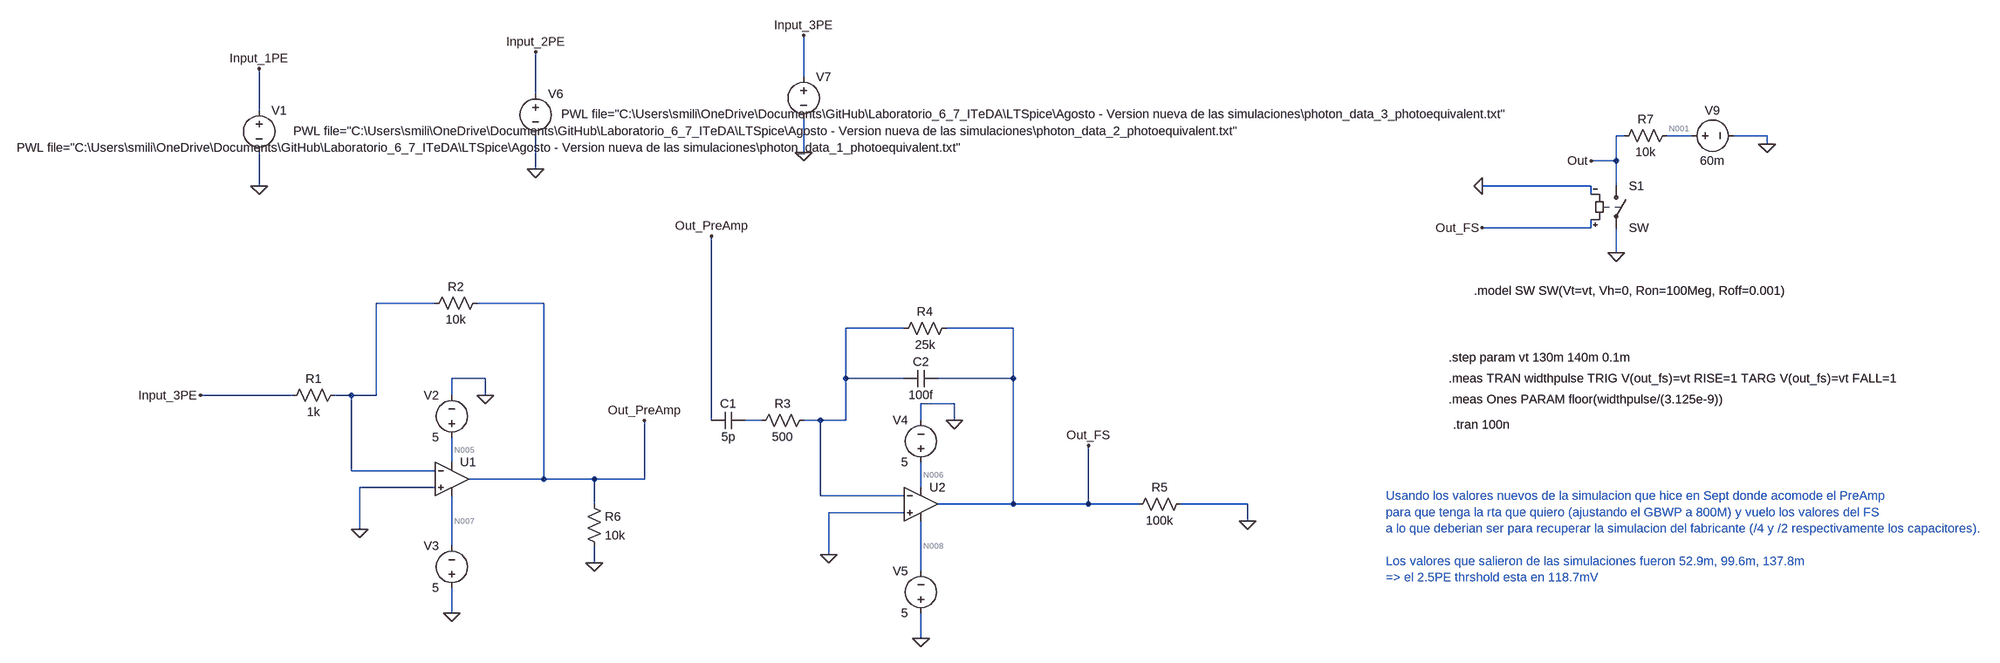
[diagram p0: schematic threshold_calculator_new_ajustada_a_ojo.asc]
threshold_calculator_new_ajustada_a_ojo.asc, the LTspice schematic file:
Version 4
SHEET 1 2936 852
WIRE 576 -656 576 -736
WIRE 64 -624 64 -704
WIRE -464 -592 -464 -672
WIRE 2144 -544 2128 -544
WIRE 2272 -544 2224 -544
WIRE 2416 -544 2352 -544
WIRE 2416 -528 2416 -544
WIRE 576 -512 576 -576
WIRE 2128 -496 2128 -544
WIRE 2128 -496 2080 -496
WIRE 64 -480 64 -544
WIRE -464 -448 -464 -512
WIRE 2080 -448 1872 -448
WIRE 2128 -448 2128 -496
WIRE 2080 -432 2080 -448
WIRE 2080 -368 2080 -384
WIRE 2080 -368 1872 -368
WIRE 2128 -320 2128 -368
WIRE -128 -224 -240 -224
WIRE 80 -224 -48 -224
WIRE 768 -176 656 -176
WIRE 976 -176 848 -176
WIRE -32 -80 -96 -80
WIRE 656 -80 656 -176
WIRE 768 -80 656 -80
WIRE 976 -80 976 -176
WIRE 976 -80 832 -80
WIRE -400 -48 -576 -48
WIRE -288 -48 -320 -48
WIRE -240 -48 -240 -224
WIRE -240 -48 -288 -48
WIRE -96 -48 -96 -80
WIRE -32 -48 -32 -80
WIRE 864 -32 800 -32
WIRE 400 0 400 -352
WIRE 496 0 464 0
WIRE 608 0 576 0
WIRE 656 0 656 -80
WIRE 656 0 608 0
WIRE 800 0 800 -32
WIRE 864 0 864 -32
WIRE -96 80 -96 32
WIRE -288 96 -288 -48
WIRE -128 96 -288 96
WIRE 80 112 80 -224
WIRE 80 112 -64 112
WIRE 176 112 80 112
WIRE 272 112 272 0
WIRE 272 112 176 112
WIRE -128 128 -272 128
WIRE 800 128 800 80
WIRE 608 144 608 0
WIRE 768 144 608 144
WIRE 176 160 176 112
WIRE 976 160 976 -80
WIRE 976 160 832 160
WIRE 1120 160 1120 48
WIRE 1120 160 976 160
WIRE 1216 160 1120 160
WIRE 1424 160 1296 160
WIRE 768 176 624 176
WIRE 1424 192 1424 160
WIRE -272 208 -272 128
WIRE -96 240 -96 144
WIRE 624 256 624 176
WIRE 176 272 176 240
WIRE 800 288 800 192
WIRE -96 368 -96 320
WIRE 800 416 800 368
FLAG -96 368 0
FLAG -32 -48 0
FLAG -464 -448 0
FLAG -272 208 0
FLAG 800 416 0
FLAG 864 0 0
FLAG 624 256 0
FLAG 272 0 Out_PreAmp
FLAG 1120 48 Out_FS
FLAG 1424 192 0
FLAG 400 -352 Out_PreAmp
FLAG -464 -672 Input_1PE
FLAG 64 -480 0
FLAG 64 -704 Input_2PE
FLAG -576 -48 Input_3PE
FLAG 176 272 0
FLAG 576 -512 0
FLAG 576 -736 Input_3PE
FLAG 2128 -320 0
FLAG 2416 -528 0
FLAG 2080 -496 Out
FLAG 1872 -448 0
FLAG 1872 -368 Out_FS
SYMBOL res -304 -64 R90
WINDOW 0 0 56 VBottom 2
WINDOW 3 32 56 VTop 2
SYMATTR InstName R1
SYMATTR Value 1k
SYMBOL res -32 -240 R90
WINDOW 0 0 56 VBottom 2
WINDOW 3 32 56 VTop 2
SYMATTR InstName R2
SYMATTR Value 10k
SYMBOL voltage -96 48 R180
WINDOW 0 24 96 Left 2
WINDOW 3 24 16 Left 2
WINDOW 123 0 0 Left 0
WINDOW 39 0 0 Left 0
SYMATTR InstName V2
SYMATTR Value 5
SYMBOL voltage -96 336 R180
WINDOW 0 24 96 Left 2
WINDOW 3 24 16 Left 2
WINDOW 123 0 0 Left 0
WINDOW 39 0 0 Left 0
SYMATTR InstName V3
SYMATTR Value 5
SYMBOL OpAmps\\UniversalOpAmp1 -96 112 R0
SYMATTR InstName U1
SYMATTR Value2 Avol=1Meg GBW=800Meg Vos=0
SYMBOL res 592 -16 R90
WINDOW 0 0 56 VBottom 2
WINDOW 3 32 56 VTop 2
SYMATTR InstName R3
SYMATTR Value 500
SYMBOL res 864 -192 R90
WINDOW 0 0 56 VBottom 2
WINDOW 3 32 56 VTop 2
SYMATTR InstName R4
SYMATTR Value 25k
SYMBOL voltage 800 96 R180
WINDOW 0 24 96 Left 2
WINDOW 3 24 16 Left 2
WINDOW 123 0 0 Left 0
WINDOW 39 0 0 Left 0
SYMATTR InstName V4
SYMATTR Value 5
SYMBOL voltage 800 384 R180
WINDOW 0 24 96 Left 2
WINDOW 3 24 16 Left 2
WINDOW 123 0 0 Left 0
WINDOW 39 0 0 Left 0
SYMATTR InstName V5
SYMATTR Value 5
SYMBOL OpAmps\\UniversalOpAmp1 800 160 R0
SYMATTR InstName U2
SYMATTR Value2 Avol=1Meg GBW=800Meg Vos=0
SYMBOL voltage -464 -608 R0
WINDOW 3 -463 87 Left 2
WINDOW 123 0 0 Left 0
WINDOW 39 0 0 Left 0
SYMATTR Value PWL file="C:\Users\smili\OneDrive\Documents\GitHub\Laboratorio_6_7_ITeDA\LTSpice\Agosto - Version nueva de las simulaciones\photon_data_1_photoequivalent.txt"
SYMATTR InstName V1
SYMBOL res 1312 144 R90
WINDOW 0 0 56 VBottom 2
WINDOW 3 32 56 VTop 2
SYMATTR InstName R5
SYMATTR Value 100k
SYMBOL cap 464 -16 R90
WINDOW 0 0 32 VBottom 2
WINDOW 3 32 32 VTop 2
SYMATTR InstName C1
SYMATTR Value 5p
SYMBOL cap 832 -96 R90
WINDOW 0 0 32 VBottom 2
WINDOW 3 32 32 VTop 2
SYMATTR InstName C2
SYMATTR Value 100f
SYMBOL voltage 64 -640 R0
WINDOW 3 -463 87 Left 2
WINDOW 123 0 0 Left 0
WINDOW 39 0 0 Left 0
SYMATTR Value PWL file="C:\Users\smili\OneDrive\Documents\GitHub\Laboratorio_6_7_ITeDA\LTSpice\Agosto - Version nueva de las simulaciones\photon_data_2_photoequivalent.txt"
SYMATTR InstName V6
SYMBOL res 160 144 R0
SYMATTR InstName R6
SYMATTR Value 10k
SYMBOL voltage 576 -672 R0
WINDOW 3 -463 87 Left 2
WINDOW 123 0 0 Left 0
WINDOW 39 0 0 Left 0
SYMATTR Value PWL file="C:\Users\smili\OneDrive\Documents\GitHub\Laboratorio_6_7_ITeDA\LTSpice\Agosto - Version nueva de las simulaciones\photon_data_3_photoequivalent.txt"
SYMATTR InstName V7
SYMBOL sw 2128 -464 R0
SYMATTR InstName S1
SYMBOL voltage 2256 -544 R270
WINDOW 0 32 56 VTop 2
WINDOW 3 -32 56 VBottom 2
WINDOW 123 0 0 Left 0
WINDOW 39 0 0 Left 0
SYMATTR InstName V9
SYMATTR Value 60m
SYMBOL res 2240 -560 R90
WINDOW 0 0 56 VBottom 2
WINDOW 3 32 56 VTop 2
SYMATTR InstName R7
SYMATTR Value 10k
TEXT 1816 8 Left 2 !.tran 100n
TEXT 1856 -248 Left 2 !.model SW SW(Vt=vt, Vh=0, Ron=100Meg, Roff=0.001)
TEXT 1808 -120 Left 2 !.step param vt 130m 140m 0.1m
TEXT 1808 -40 Left 2 !.meas Ones PARAM floor(widthpulse/(3.125e-9))
TEXT 1808 -80 Left 2 !.meas TRAN widthpulse TRIG V(out_fs)=vt RISE=1 TARG V(out_fs)=vt FALL=1
TEXT 1688 144 Left 2 ;Usando los valores nuevos de la simulacion que hice en Sept donde acomode el PreAmp\npara que tenga la rta que quiero (ajustando el GBWP a 800M) y vuelo los valores del FS\na lo que deberian ser para recuperar la simulacion del fabricante (/4 y /2 respectivamente los capacitores).\n \nLos valores que salieron de las simulaciones fueron 52.9m, 99.6m, 137.8m\n=> el 2.5PE thrshold esta en 118.7mV

The netlist it stands for:
* threshold_calculator_new_ajustada_a_ojo.asc
R1 N002 Input_3PE 1k
R2 Out_PreAmp N002 10k
V2 N005 0 5
V3 0 N007 5
XU1 0 N002 N005 N007 Out_PreAmp level1 Avol=1Meg GBW=800Meg Vos=0 En=0 Enk=0 In=0 Ink=0 Rin=500Meg  ; pins In+ In- V+ V- OUT
R3 N003 N004 500
R4 Out_FS N003 25k
V4 N006 0 5
V5 0 N008 5
XU2 0 N003 N006 N008 Out_FS level1 Avol=1Meg GBW=800Meg Vos=0 En=0 Enk=0 In=0 Ink=0 Rin=500Meg  ; pins In+ In- V+ V- OUT
V1 Input_1PE 0 PWL file="C:\Users\smili\OneDrive\Documents\GitHub\Laboratorio_6_7_ITeDA\LTSpice\Agosto - Version nueva de las simulaciones\photon_data_1_photoequivalent.txt"
R5 0 Out_FS 100k
C1 N004 Out_PreAmp 5p
C2 Out_FS N003 100f
V6 Input_2PE 0 PWL file="C:\Users\smili\OneDrive\Documents\GitHub\Laboratorio_6_7_ITeDA\LTSpice\Agosto - Version nueva de las simulaciones\photon_data_2_photoequivalent.txt"
R6 Out_PreAmp 0 10k
V7 Input_3PE 0 PWL file="C:\Users\smili\OneDrive\Documents\GitHub\Laboratorio_6_7_ITeDA\LTSpice\Agosto - Version nueva de las simulaciones\photon_data_3_photoequivalent.txt"
S1 Out 0 Out_FS 0 SW
V9 N001 0 60m
R7 N001 Out 10k
.tran 100n
.model SW SW(Vt=vt, Vh=0, Ron=100Meg, Roff=0.001)
.step param vt 130m 140m 0.1m
.meas Ones PARAM floor(widthpulse/(3.125e-9))
.meas TRAN widthpulse TRIG V(out_fs)=vt RISE=1 TARG V(out_fs)=vt FALL=1
* Usando los valores nuevos de la simulacion que hice en Sept donde acomode el PreAmp
* para que tenga la rta que quiero (ajustando el GBWP a 800M) y vuelo los valores del FS
* a lo que deberian ser para recuperar la simulacion del fabricante (/4 y /2 respectivamente los capacitores).
* Los valores que salieron de las simulaciones fueron 52.9m, 99.6m, 137.8m
* => el 2.5PE thrshold esta en 118.7mV
.lib UniversalOpAmp1.lib
.backanno
.end

* Results of the author's LTspice run, read from the files saved beside the schematic
* Operating Point (first step), zero values left out:
*   vt = 130 m
*   V(n005) = 5 V
*   V(n007) = -5 V
*   V(n006) = 5 V
*   V(n008) = -5 V
*   V(out) = 6 nV
*   V(n001) = 60 mV
*   I(R7) = 6 µA
*   I(S1) = -6 µA
*   I(V2) = -10 nA
*   I(V3) = -10 nA
*   I(V4) = -10 nA
*   I(V5) = -10 nA
*   I(V9) = -6 µA
*   Ix(u1:3) = 10 nA
*   Ix(u1:4) = -10 nA
*   Ix(u2:3) = 10 nA
*   Ix(u2:4) = -10 nA
* From the log:
*   Measurement: ones
*     step  floor(widthpulse/(3.125e-9))
*        1  1
*        2  1
*        3  1
*        4  1
*        5  1
*        6  1
*        7  1
*        8  1
*        9  1
*       10  1
*       11  1
*       12  1
*       13  1
*       14  1
*       15  1
*       16  1
*       17  1
*       18  1
*       19  1
*       20  1
*       21  1
*       22  1
*       23  1
*       24  1
*       25  1
*       26  1
*       27  1
*       28  1
*       29  1
*       30  1
*       31  1
*       32  1
*       33  1
*       34  1
*       35  1
*       36  1
*       37  1
*       38  1
*       39  1
*       40  1
*     ...
*   Measurement: widthpulse
*     step  widthpulse  FROM  TO
*        1  4.29372e-09  4.8056e-09  9.09932e-09
*        2  4.28047e-09  4.81101e-09  9.09148e-09
*        3  4.26719e-09  4.81644e-09  9.08362e-09
*        4  4.25385e-09  4.82189e-09  9.07575e-09
*        5  4.24045e-09  4.82738e-09  9.06783e-09
*        6  4.22701e-09  4.83286e-09  9.05987e-09
*        7  4.21357e-09  4.83834e-09  9.05191e-09
*        8  4.20009e-09  4.84385e-09  9.04395e-09
*        9  4.1866e-09  4.84939e-09  9.03599e-09
*       10  4.17307e-09  4.85492e-09  9.02799e-09
*       11  4.15954e-09  4.86046e-09  9.02e-09
*       12  4.14598e-09  4.86599e-09  9.01197e-09
*       13  4.13236e-09  4.87155e-09  9.00391e-09
*       14  4.11861e-09  4.87719e-09  8.9958e-09
*       15  4.10485e-09  4.88284e-09  8.98769e-09
*       16  4.09104e-09  4.88854e-09  8.97958e-09
*       17  4.07721e-09  4.89424e-09  8.97145e-09
*       18  4.06335e-09  4.89995e-09  8.9633e-09
*       19  4.04945e-09  4.90571e-09  8.95515e-09
*       20  4.0355e-09  4.91147e-09  8.94697e-09
*       21  4.02153e-09  4.91723e-09  8.93876e-09
*       22  4.0075e-09  4.92299e-09  8.93049e-09
*       23  3.99347e-09  4.92875e-09  8.92222e-09
*       24  3.97941e-09  4.93451e-09  8.91392e-09
*       25  3.96525e-09  4.94037e-09  8.90562e-09
*       26  3.95104e-09  4.94626e-09  8.89731e-09
*       27  3.93681e-09  4.95217e-09  8.88898e-09
*       28  3.9225e-09  4.95813e-09  8.88063e-09
*       29  3.90815e-09  4.9641e-09  8.87225e-09
*       30  3.89373e-09  4.97007e-09  8.8638e-09
*       31  3.87927e-09  4.97606e-09  8.85533e-09
*       32  3.86477e-09  4.98209e-09  8.84686e-09
*       33  3.85027e-09  4.98812e-09  8.83839e-09
*       34  3.83575e-09  4.99415e-09  8.82989e-09
*       35  3.8212e-09  5.00018e-09  8.82138e-09
*       36  3.80658e-09  5.00626e-09  8.81284e-09
*       37  3.79184e-09  5.01241e-09  8.80425e-09
*       38  3.777e-09  5.0186e-09  8.7956e-09
*       39  3.76212e-09  5.02483e-09  8.78695e-09
*       40  3.74724e-09  5.03105e-09  8.7783e-09
*     ...